# Altium schematic sheet Filter.SchDoc: <Document>
size Letter; Engineer: <Engineer>; Organization: UPEL; Address1: USU Power Electronics Lab; Address2: USTAR Building 620, RM 118; Address3: 1600 N 620 E; Address4: North Logan, UT 84341; DocumentNumber: 14; Revision: v1; SheetNumber: 14; SheetTotal: 16; ProjectName: <Project>
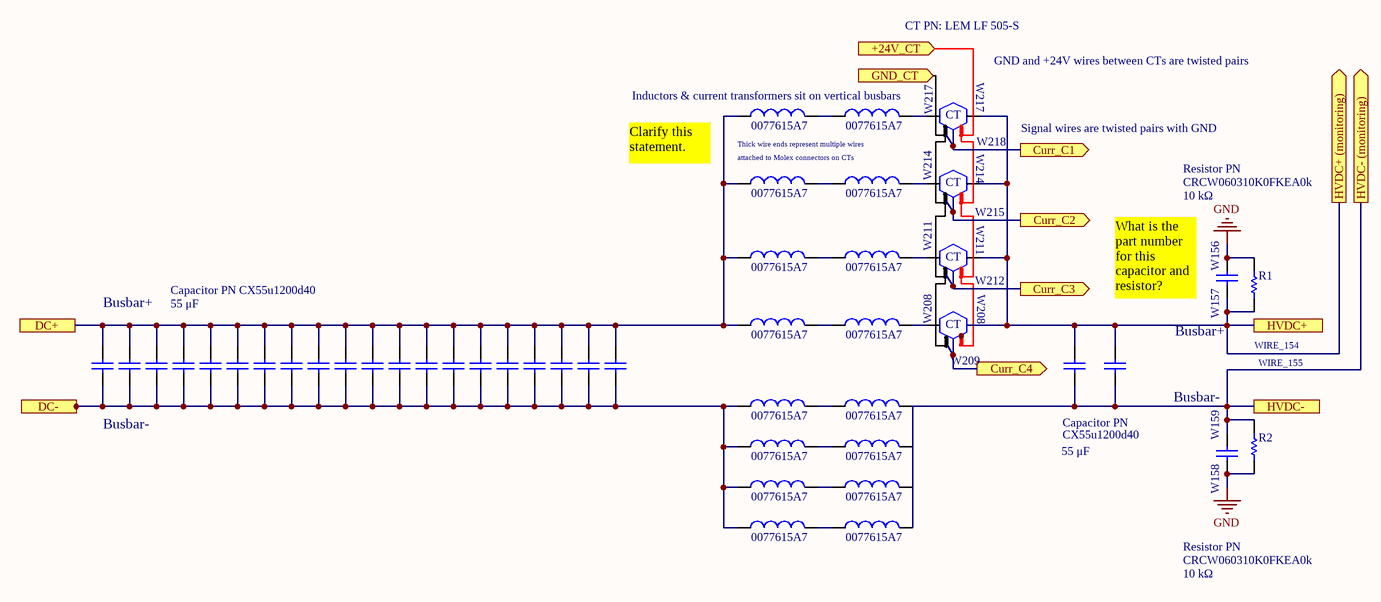
[diagram p0: Filter.SchDoc]

## Parts
(Parts that share a designator on the sheet are numbered #1, #2 ... from top to bottom, then left to right.)
*?#1  0077615A7
*?#2  0077615A7
*?#3  LEM LF 505-S  (value not drawn)
*?#4  0077615A7
*?#5  0077615A7
*?#6  LEM LF 505-S  (value not drawn)
*?#7  0077615A7
*?#8  0077615A7
*?#9  LEM LF 505-S  (value not drawn)
*?#10  0077615A7
*?#11  0077615A7
*?#12  CT PN: LEM LF 505-S
*?#13  0077615A7
*?#14  0077615A7
*?#15  0077615A7
*?#16  0077615A7
*?#17  0077615A7
*?#18  0077615A7
*?#19  0077615A7
*?#20  0077615A7
C?#1  Capacitor  (value not drawn)
C?#2  CX55u1200d40
C?#3  Capacitor PN CX55u1200d40
C?#4  Capacitor  (value not drawn)
C?#5  Capacitor  (value not drawn)
C?#6  Capacitor  (value not drawn)
C?#7  Capacitor  (value not drawn)
C?#8  Capacitor  (value not drawn)
C?#9  Capacitor  (value not drawn)
C?#10  Capacitor  (value not drawn)
C?#11  Capacitor  (value not drawn)
C?#12  Capacitor  (value not drawn)
C?#13  Capacitor  (value not drawn)
C?#14  Capacitor  (value not drawn)
C?#15  Capacitor  (value not drawn)
C?#16  Capacitor  (value not drawn)
C?#17  Capacitor  (value not drawn)
C?#18  Capacitor  (value not drawn)
C?#19  Capacitor  (value not drawn)
C?#20  Capacitor  (value not drawn)
C?#21  Capacitor  (value not drawn)
C?#22  Capacitor  (value not drawn)
C?#23  944U470K122AA  (value not drawn)
C?#24  Capacitor  (value not drawn)
R1  CRCW060310K0FKEA0k  [0603 RESISTOR]
R2  10k  [0603 RESISTOR]  (value not drawn)

## Ports
+24V_CT (in), Curr_C1 (out), Curr_C2 (out), Curr_C3 (out), Curr_C4 (out), DC+, DC-, GND_CT (in), HVDC+, HVDC+ (monitoring) (out), HVDC-, HVDC- (monitoring) (out)

## Nets
GND: C?#1.1 C?#24.1 R1.2 R2.2
DC+: C?#3.2 C?#4.2 C?#5.2 C?#6.2 C?#7.2 C?#8.2 C?#9.2 C?#10.2 C?#11.2 C?#12.2 C?#13.2 C?#14.2 C?#15.2 C?#16.2 C?#17.2 C?#18.2 C?#19.2 C?#20.2 C?#21.2 C?#22.2 ; port DC+
DC-: C?#3.1 C?#4.1 C?#5.1 C?#6.1 C?#7.1 C?#8.1 C?#9.1 C?#10.1 C?#11.1 C?#12.1 C?#13.1 C?#14.1 C?#15.1 C?#16.1 C?#17.1 C?#18.1 C?#19.1 C?#20.1 C?#21.1 C?#22.1 ; port DC-
HVDC+: *?#12.8 C?#1.2 C?#2.1 C?#23.2 R1.1 ; port HVDC+, port HVDC+ (monitoring)
HVDC-: C?#2.2 C?#23.1 C?#24.2 R2.1 ; port HVDC-, port HVDC- (monitoring)

Not connected (* = marked no-connect by the designer): *?#1 11 12; *?#2 11 12; *?#3 7 8; *?#4 11 12; *?#5 11 12; *?#6 7 8; *?#7 11 12; *?#8 11 12; *?#9 7 8; *?#10 11 12; *?#11 11 12; *?#12 7; *?#13 11 12; *?#14 11 12; *?#15 11 12; *?#16 11 12; *?#17 11 12; *?#18 11 12; *?#19 11 12; *?#20 11 12

## Notes on the sheet
- (near *?#3) W217
- (near *?#3) GND and +24V wires between CTs are twisted pairs
- (near *?#3) Inductors & current transformers sit on vertical busbars
- (near *?#1) Thick wire ends represent multiple wires
- (near *?#6) W214
- (near *?#3) W218
- (near *?#3) Signal wires are twisted pairs with GND
- (near *?#1) Clarify this statement.
- (near *?#4) attached to Molex connectors on CTs
- (near *?#6) W215
- 10 kΩ
- Resistor PN
- (near *?#9) W211
- (near *?#9) W212
- (near C?#1) W156
- (near C?#4) Busbar+
- (near C?#6) 55 μF
- (near *?#12) W208
- (near C?#1) What is the part number for this capacitor and resistor?
- Busbar+
- (near C?#1) W157
- WIRE_154
- (near *?#12) W209
- Busbar-
- WIRE_155
- (near C?#4) Busbar-
- 55 μF
- (near C?#23) Capacitor PN
- (near C?#24) W159
- (near C?#24) W158
- CRCW060310K0FKEA0k
- Project:
- Engineer:
- Document:
- Approved By:
- Date:
- Revision:
- File:
- Sheet
- of
- (in symbol Current_Sensor) CT

## Library data of the parts
*?#1 *?#2 *?#4 *?#5 *?#7 *?#8 *?#10 *?#11 *?#13-*?#20 = CMP-006-000014-3: 116.8 nH Toroid
*?#3 *?#6 *?#9 *?#12 = Current_Sensor
C?#1-C?#24 = Capacitor: SimulationGenericComponent: True; Value: 1p
R1 R2 = CRCW060310K0FKEA: 10 kOhms ±1% 0.1W, 1/10W Chip Resistor 0603 (1608 Metric) Automotive AEC-Q200 Thick Film; Supplier 1: Digi-Key; Supplier Part Number 1: 541-10.0KHCT-ND